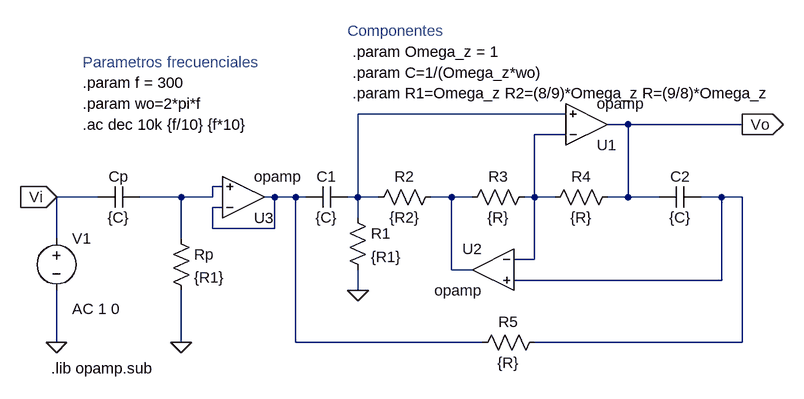
[diagram p0: schematic TS5_SalidaOperacional.asc]
TS5_SalidaOperacional.asc, the LTspice schematic file:
Version 4
SHEET 1 1276 680
WIRE 864 -16 544 -16
WIRE 960 0 928 0
WIRE 1136 0 960 0
WIRE 864 16 816 16
WIRE 336 96 320 96
WIRE 144 112 80 112
WIRE 272 112 208 112
WIRE 320 112 320 96
WIRE 320 112 272 112
WIRE 416 112 400 112
WIRE 448 112 416 112
WIRE 464 112 448 112
WIRE 544 112 544 -16
WIRE 544 112 528 112
WIRE 576 112 544 112
WIRE 688 112 656 112
WIRE 720 112 688 112
WIRE 816 112 816 16
WIRE 816 112 800 112
WIRE 848 112 816 112
WIRE 960 112 960 0
WIRE 960 112 928 112
WIRE 1008 112 960 112
WIRE 1104 112 1072 112
WIRE 1136 112 1104 112
WIRE 336 128 320 128
WIRE 544 144 544 112
WIRE 320 160 320 128
WIRE 416 160 416 112
WIRE 416 160 320 160
WIRE 80 176 80 112
WIRE 272 176 272 112
WIRE 816 208 816 112
WIRE 816 208 784 208
WIRE 688 224 688 112
WIRE 720 224 688 224
WIRE 1104 240 1104 112
WIRE 1104 240 784 240
WIRE 544 256 544 224
WIRE 80 336 80 256
WIRE 272 336 272 256
WIRE 448 336 448 112
WIRE 736 336 448 336
WIRE 1136 336 1136 112
WIRE 1136 336 816 336
FLAG 1136 0 Vo
IOPIN 1136 0 Out
FLAG 80 112 Vi
IOPIN 80 112 In
FLAG 544 256 0
FLAG 272 336 0
FLAG 80 336 0
SYMBOL cap 528 96 R90
WINDOW 0 0 32 VBottom 2
WINDOW 3 32 32 VTop 2
SYMATTR InstName C1
SYMATTR Value {C}
SYMBOL OpAmps\\opamp 896 64 M180
SYMATTR InstName U1
SYMBOL OpAmps\\opamp 752 160 M0
SYMATTR InstName U2
SYMBOL res 672 96 R90
WINDOW 0 0 56 VBottom 2
WINDOW 3 32 56 VTop 2
SYMATTR InstName R2
SYMATTR Value {R2}
SYMBOL res 944 96 R90
WINDOW 0 0 56 VBottom 2
WINDOW 3 32 56 VTop 2
SYMATTR InstName R4
SYMATTR Value {R}
SYMBOL cap 1072 96 R90
WINDOW 0 0 32 VBottom 2
WINDOW 3 32 32 VTop 2
SYMATTR InstName C2
SYMATTR Value {C}
SYMBOL res 816 96 R90
WINDOW 0 0 56 VBottom 2
WINDOW 3 32 56 VTop 2
SYMATTR InstName R3
SYMATTR Value {R}
SYMBOL res 528 128 R0
SYMATTR InstName R1
SYMATTR Value {R1}
SYMBOL res 832 320 R90
WINDOW 0 0 56 VBottom 2
WINDOW 3 32 56 VTop 2
SYMATTR InstName R5
SYMATTR Value {R}
SYMBOL cap 208 96 R90
WINDOW 0 0 32 VBottom 2
WINDOW 3 32 32 VTop 2
SYMATTR InstName Cp
SYMATTR Value {C}
SYMBOL res 256 160 R0
SYMATTR InstName Rp
SYMATTR Value {R1}
SYMBOL voltage 80 160 R0
WINDOW 123 24 124 Left 2
WINDOW 39 0 0 Left 0
SYMATTR Value2 AC 1 0
SYMATTR InstName V1
SYMATTR Value ""
SYMBOL OpAmps\\opamp 368 176 M180
SYMATTR InstName U3
TEXT 120 -32 Left 2 !.param wo=2*pi*f
TEXT 72 376 Left 2 !.lib opamp.sub
TEXT 120 -64 Left 2 !.param f = 300
TEXT 536 -80 Left 2 !.param C=1/(Omega_z*wo)
TEXT 120 0 Left 2 !.ac dec 10k {f/10} {f*10}
TEXT 120 -96 Left 2 ;Parametros frecuenciales
TEXT 528 -144 Left 2 ;Componentes
TEXT 536 -112 Left 2 !.param Omega_z = 1
TEXT 536 -48 Left 2 !.param R1=Omega_z R2=(8/9)*Omega_z R=(9/8)*Omega_z

The netlist it stands for:
* TS5_SalidaOperacional.asc
C1 N001 N004 {C}
XU1 N002 N001 Vo opamp Aol=100K GBW=10Meg  ; pins invin noninvin out
XU2 N002 N006 N005 opamp Aol=100K GBW=10Meg  ; pins invin noninvin out
R2 N005 N001 {R2}
R4 Vo N002 {R}
C2 N006 Vo {C}
R3 N002 N005 {R}
R1 N001 0 {R1}
R5 N006 N004 {R}
Cp N003 Vi {C}
Rp N003 0 {R1}
V1 Vi 0 AC 1 0
XU3 N004 N003 N004 opamp Aol=100K GBW=10Meg  ; pins invin noninvin out
.param wo=2*pi*f
.lib opamp.sub
.param f = 300
.param C=1/(Omega_z*wo)
.ac dec 10k {f/10} {f*10}
* Parametros frecuenciales
* Componentes
.param Omega_z = 1
.param R1=Omega_z R2=(8/9)*Omega_z R=(9/8)*Omega_z
.backanno
.end